# Altium schematic sheet Power Regulation.SchDoc: OTG Dock Puck
size A; Date: 12/6/2021; ApprovedBy: KEW; CheckedBy: KEW; Author: KEW; CompanyName: Gamber-Johnson LLC; Engineer: KEW; Organization: Gamber-Johnson LLC; Address1: 5001 Joerns Dr.; Address2: Stevens Point; Address3: WI, 54481; DocumentNumber: KEW-OTG; DrawnBy: KEW; RevisionEngineer: KEW; ProjectTitle: USB-OTG Puck; Revision: X2; SheetNumber: 4; SheetTotal: 5; RevisionDescription: Updated pads for X1,2 and RJ45 Port; DrawnByDate: 1/18/2023; ProjectNumber: TBD; AssemblyNumber: 7150-XXXX; RevisionDate: 1/25/2023; SheetTitle: Power Regulation; Time: 9:34 AM; Application_BuildNumber: 7150-XXX
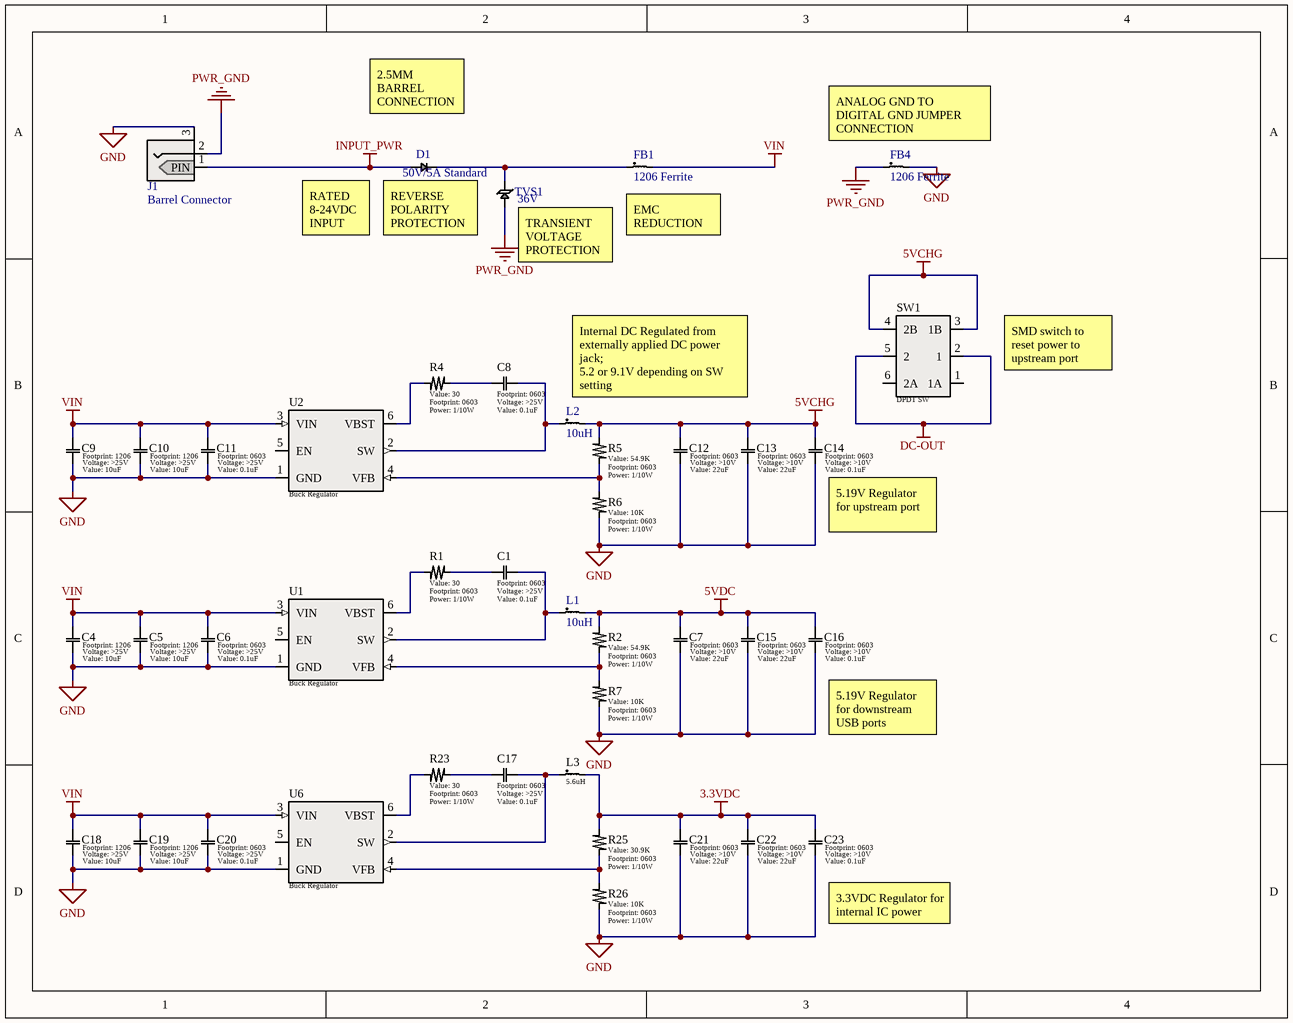
[diagram p0: Power Regulation.SchDoc]

## Parts
C1  value 0.1uF  Voltage: >25V  [0603]  (hidden comment: Generic Capacitor)
C4  value 10uF  Voltage: >25V  [1206]  (hidden comment: Generic Capacitor)
C5  value 10uF  Voltage: >25V  [1206]  (hidden comment: Generic Capacitor)
C6  value 0.1uF  Voltage: >25V  [0603]  (hidden comment: Generic Capacitor)
C7  value 22uF  Voltage: >10V  [0603]  (hidden comment: Generic Capacitor)
C8  value 0.1uF  Voltage: >25V  [0603]  (hidden comment: Generic Capacitor)
C9  value 10uF  Voltage: >25V  [1206]  (hidden comment: Generic Capacitor)
C10  value 10uF  Voltage: >25V  [1206]  (hidden comment: Generic Capacitor)
C11  value 0.1uF  Voltage: >25V  [0603]  (hidden comment: Generic Capacitor)
C12  value 22uF  Voltage: >10V  [0603]  (hidden comment: Generic Capacitor)
C13  value 22uF  Voltage: >10V  [0603]  (hidden comment: Generic Capacitor)
C14  value 0.1uF  Voltage: >10V  [0603]  (hidden comment: Generic Capacitor)
C15  value 22uF  Voltage: >10V  [0603]  (hidden comment: Generic Capacitor)
C16  value 0.1uF  Voltage: >10V  [0603]  (hidden comment: Generic Capacitor)
C17  value 0.1uF  Voltage: >25V  [0603]  (hidden comment: Generic Capacitor)
C18  value 10uF  Voltage: >25V  [1206]  (hidden comment: Generic Capacitor)
C19  value 10uF  Voltage: >25V  [1206]  (hidden comment: Generic Capacitor)
C20  value 0.1uF  Voltage: >25V  [0603]  (hidden comment: Generic Capacitor)
C21  value 22uF  Voltage: >10V  [0603]  (hidden comment: Generic Capacitor)
C22  value 22uF  Voltage: >10V  [0603]  (hidden comment: Generic Capacitor)
C23  value 0.1uF  Voltage: >10V  [0603]  (hidden comment: Generic Capacitor)
D1  50V/5A Standard  [DO-214AC]
FB1  1206 Ferrite  [1206]
FB4  1206 Ferrite  [1206]
J1  Barrel Connector  [PJ-082BH]
L1  10uH  [SMD 8.2x8.6mm]
L2  10uH  [SMD 8.2x8.6mm]
L3  5.6uH  [TMPC0402HP]
R1  value 30  Power: 1/10W  [0603]  (hidden comment: Generic Resistor)
R2  value 54.9K  Power: 1/10W  [0603]  (hidden comment: Generic Resistor)
R4  value 30  Power: 1/10W  [0603]  (hidden comment: Generic Resistor)
R5  value 54.9K  Power: 1/10W  [0603]  (hidden comment: Generic Resistor)
R6  value 10K  Power: 1/10W  [0603]  (hidden comment: Generic Resistor)
R7  value 10K  Power: 1/10W  [0603]  (hidden comment: Generic Resistor)
R23  value 30  Power: 1/10W  [0603]  (hidden comment: Generic Resistor)
R25  value 30.9K  Power: 1/10W  [0603]  (hidden comment: Generic Resistor)
R26  value 10K  Power: 1/10W  [0603]  (hidden comment: Generic Resistor)
SW1  DPDT SW  [SMD-DPDT-SW]
TVS1  36V  [DO-214AC]
U1  Buck Regulator  [TSOT-23-6]
U2  Buck Regulator  [TSOT-23-6]
U6  Buck Regulator  [TSOT-23-6]

## Nets
3.3VDC: C21.1 C22.1 C23.1 L3.2 R25.2
5VCHG: C12.1 C13.1 C14.1 L2.2 R5.2 SW1.3(1B) SW1.4(2B)
5VDC: C7.1 C15.1 C16.1 L1.2 R2.2
DC-OUT: SW1.2(1) SW1.5(2)
GND: C4.2 C5.2 C6.2 C7.2 C9.2 C10.2 C11.2 C12.2 C13.2 C14.2 C15.2 C16.2 C18.2 C19.2 C20.2 C21.2 C22.2 C23.2 FB4.2 J1.3(SHD_B) R6.1 R7.1 R26.1 U1.1(GND) U2.1(GND) U6.1(GND)
INPUT_PWR: D1.2(Anode) J1.1(PIN)
PWR_GND: FB4.1 J1.2(SHD_A) TVS1.2(Anode)
VIN: C4.1 C5.1 C6.1 C9.1 C10.1 C11.1 C18.1 C19.1 C20.1 FB1.2 U1.3(VIN) U2.3(VIN) U6.3(VIN)
NetC1_1: C1.1 R1.2
NetC1_2: C1.2 L1.1 U1.2(SW)
NetC8_1: C8.1 R4.2
NetC8_2: C8.2 L2.1 U2.2(SW)
NetC17_1: C17.1 R23.2
NetC17_2: C17.2 L3.1 U6.2(SW)
NetD1_1: D1.1(Cathode) FB1.1 TVS1.1(Cathode)
NetR1_1: R1.1 U1.6(VBST)
NetR2_1: R2.1 R7.2 U1.4(VFB)
NetR4_1: R4.1 U2.6(VBST)
NetR5_1: R5.1 R6.2 U2.4(VFB)
NetR23_1: R23.1 U6.6(VBST)
NetR25_1: R25.1 R26.2 U6.4(VFB)

Not connected (* = marked no-connect by the designer): SW1 1(1A) 6(2A); U1 5(EN); U2 5(EN); U6 5(EN)

## Notes on the sheet
- 2.5MM BARREL CONNECTION
- (near FB4) ANALOG GND TO DIGITAL GND JUMPER CONNECTION
- (near D1) RATED 8-24VDC INPUT
- (near D1) REVERSE POLARITY PROTECTION
- (near FB1) EMC REDUCTION
- (near TVS1) TRANSIENT VOLTAGE PROTECTION
- SMD switch to reset power to upstream port
- (near L2) Internal DC Regulated from
  externally applied DC power jack;
  5.2 or 9.1V depending on SW setting
- (near C14) 5.19V Regulator for upstream port
- (near C16) 5.19V Regulator for downstream USB ports
- (near C23) 3.3VDC Regulator for internal IC power
- REV
- REVISIONS
- DATE
- DESCRIPTION
- BY
- UNLESS OTHERWISE SPECIFIED, DRAWING DEFINITIONS AND TOLERANCES SHALL BE FOUND UNDER SUPPLIER STANDARDS SS-001. THIS PART AND ALL COMPONENTS OF IT MUST BE RoHS & REACH COMPLIANT. A CERTIFICATE OF COMPLIANCE MUST BE PROVIDED UPON REQUEST.
- ALL INFORMATION ON THIS DOCUMENT IS THE SOLE PROPERTY OF GAMBER-JOHNSON AND SHALL NOT BE COPIED, REPRODUCED, USED OR DISCLOSED IN WHOLE OR IN PART WITHOUT THE WRITTEN CONSENT OF GAMBER-JOHNSON
- TOLERANCES
  .00 ± .060
  .000 ± .020
  .0000 ± .005
  ANGELS ± 1°
- DRAWN BY:
- PROJECT NUMBER:
- SHEET TITLE:
- SHEET
- OF
- DATE:
- LOCATION:
- ASSEMBLY NUMBER
- SIZE
- GAMBER-JOHNSON LLC
  3001 BORHAM AVE.
  STEVENS POINT, WI 54481
  +1 (715) 344-5209
- B

## Library data of the parts
C1 C4-C6 C8-C11 C14 C16-C20 C23 = Generic Capacitor: Tolerance: 10%
C7 C12 C13 C15 C21 C22 = Generic Capacitor: Tolerance: 20%
D1 = SBRT5A50SA-13: Diode Super Barrier 50V 5A Surface Mount; Manufacturer 1: Diodes; Element Configuration: Single; Forward Voltage: 460mV; Max Forward Surge Current (Ifsm): 70A; Max Reverse Current: 45mA; Supplier 1: Digi-Key; Manufacturer Part Number 1: SBRT5A50SA-13; RoHS: Yes; Category: Rectifier Diodes; Stock 1: 218992; Pricing 1: 1=0.49000, 10=0.38200, 100=0.22900, 500=0.21200, 1000=0.14416, 2000=0.13271 (USD); Mount: Surface Mount; Case/Package: SMA; Weight: 0.002258oz; Min Operating Temperature: -55°C; Max Operating Temperature: 150°C; Packaging: Tape and Reel; Average Rectified Current: 5A; Max Repetitive Reverse Voltage (Vrrm): 50V; Package Quantity: 5000; Max Reverse Voltage (DC): 50V; Lead Free: Lead Free; RoHS Compliant: Yes; ComponentLink1URL: http://www.farnell.com/datasheets/2814462.pdf?src-supplier=Farnell; ComponentLink1Description: http://www.farnell.com/datasheets/2814462.pdf?src-supplier=Farnell; ComponentLink2URL: https://www.diodes.com/assets/Datasheets/SBRT5A50SA.pdf?src-supplier=Arrow+Electronics; ComponentLink2Description: https://www.diodes.com/assets/Datasheets/SBRT5A50SA.pdf?src-supplier=Arrow+Electronics; ComponentLink3URL: https://www.diodes.com/assets/Datasheets/SBRT5A50SA.pdf?src-supplier=Mouser; ComponentLink3Description: https://www.diodes.com/assets/Datasheets/SBRT5A50SA.pdf?src-supplier=Mouser; ComponentLink4URL: https://www.diodes.com/assets/Datasheets/SBRT5A50SA.pdf?src-supplier=Avnet+Europe; ComponentLink4Description: https://www.diodes.com/assets/Datasheets/SBRT5A50SA.pdf?src-supplier=Avnet+Europe; ComponentLink5URL: http://www.farnell.com/datasheets/2814462.pdf?src-supplier=Newark; ComponentLink5Description: http://www.farnell.com/datasheets/2814462.pdf?src-supplier=Newark; ComponentLink6URL: https://www.diodes.com/assets/Datasheets/SBRT5A50SA.pdf?src-supplier=Avnet; ComponentLink6Description: https://www.diodes.com/assets/Datasheets/SBRT5A50SA.pdf?src-supplier=Avnet; ComponentLink7URL: https://www.diodes.com/assets/Datasheets/SBRT5A50SA.pdf?src-supplier=Digi-Key; ComponentLink7Description: https://www.diodes.com/assets/Datasheets/SBRT5A50SA.pdf?src-supplier=Digi-Key; ComponentLink8URL: http://www.farnell.com/datasheets/2814462.pdf?src-supplier=Element14; ComponentLink8Description: http://www.farnell.com/datasheets/2814462.pdf?src-supplier=Element14; ComponentLink9URL: https://www.diodes.com/assets/Datasheets/SBRT5A50SA.pdf?src-supplier=Verical; ComponentLink9Description: https://www.diodes.com/assets/Datasheets/SBRT5A50SA.pdf?src-supplier=Verical; Supplier Part Number 1: SBRT5A50SA-13DICT-ND
FB1 FB4 = HI1206T161R-10: 160 Ohms @ 100MHz 1 Power, Signal Line Ferrite Bead 1206 (3216 Metric) 6A 18mOhm; Manufacturer 1: Laird Steward; DC Resistance (DCR): 18mR; Number of Lines: 1; Impedance: 160R; Supplier 1: Digi-Key; Manufacturer Part Number 1: HI1206T161R-10; RoHS: Yes; Category: Fixed Inductors; Stock 1: 250713; Pricing 1: 1=0.20000, 10=0.15600, 25=0.12920, 50=0.11140, 100=0.10020, 250=0.08464, 500=0.07572, 1000=0.06458 (USD); Mount: Surface Mount; Case/Package: 1206; Weight: 0.0136oz; Case Code (Metric): 3216; Case Code (Imperial): 1206; Core Material: Ferrite; Material: Ferrite; Min Operating Temperature: -40°C; Max Operating Temperature: 125°C; Package Quantity: 1; Packaging: Tape and Reel; Max Current Rating: 6A; Current Rating: 6A; Max DC Current: 6A; Termination: SMD/SMT; Frequency: 100MHz; Test Frequency: 100MHz; Length: 3.2mm; Height: 0.071inch; Width: 0.063inch; Depth: 1.8mm; Lead Free: Lead Free; REACH SVHC: Unknown; ComponentLink1URL: https://datasheet.ciiva.com/22622/1685743-22622771.pdf?src-supplier=Element14; ComponentLink1Description: https://datasheet.ciiva.com/22622/1685743-22622771.pdf?src-supplier=Element14; ComponentLink2URL: https://datasheet.ciiva.com/16714/70065439-16714326.pdf?src-supplier=Allied+Electronics; ComponentLink2Description: https://datasheet.ciiva.com/16714/70065439-16714326.pdf?src-supplier=Allied+Electronics; Supplier Part Number 1: 240-2411-1-ND; LCSC PN: C391193
J1 = PJ-082BH: CONN PWR JACK 2.5X5.5MM SOLDER; Manufacturer 1: CUI; Gender: Male; Shielding: Shielded; Current Rating: 10A; Number of Conductors: 2; Supplier 1: Digi-Key; Manufacturer Part Number 1: PJ-082BH; RoHS: Yes; Category: Connectors; Stock 1: 24371; Pricing 1: 1=1.69000, 10=1.53600, 25=1.44200, 50=1.37940, 100=1.31670 (USD); Mount: Through Hole; Color: Black; Contact Material: Brass; Housing Material: Nylon; Contact Plating: Silver; Housing Color: Black; Min Operating Temperature: -25°C; Max Operating Temperature: 85°C; Orientation: Horizontal; Connector Type: Jack; Termination: Solder; Lead Free: Lead Free; ComponentLink1URL: https://datasheet.ciiva.com/7368/pj-082bh-7368042.pdf?src-supplier=Digi-Key; ComponentLink1Description: https://datasheet.ciiva.com/7368/pj-082bh-7368042.pdf?src-supplier=Digi-Key; ComponentLink2URL: https://datasheet.ciiva.com/7368/pj-082bh-7368045.pdf?src-supplier=Digi-Key; ComponentLink2Description: https://datasheet.ciiva.com/7368/pj-082bh-7368045.pdf?src-supplier=Digi-Key; Supplier Part Number 1: CP-082BHCT-ND; LCSC PN: C3001296
L1 L2 = IHLP3232DZER100M5A: 5.1A 10uH ±20% 5.2A - Power Inductor; Mfr_Name: Vishay; Type: DEV; Copyright: Copyright (C) 2023 Ultra Librarian. All rights reserved.; Manufacturer_Part_Number: IHLP3232DZER100M5A; RefDes: RefDes; LCSC PN: C2051768; Supplier 1: Mouser
L3 = TMPC0402HP-5R6MG-Z02: 2A 5.6uH ±20% SMD Power Inductor; LCSC PN: C357137; Supplier 1: Digi-Key; Supplier Part Number 1: 732-3339-1-ND
R1 R2 R4-R7 R23 R25 R26 = Generic Resistor: Tolerance: 1%
SW1 = MS-22D17-G2: Brick nogging DPDT Black SMD Slide Switch; LCSC PN: C2904912
TVS1 = SMAJ36A: 58.1V Clamp 6.9A Ipp Tvs Diode Surface Mount DO-214AC (SMA); Manufacturer 1: Littelfuse; Peak Pulse Power: 400W; Polarity: Unidirectional; Breakdown Voltage: 40V; Test Current: 1mA; Number of Channels: 1; Leakage Current: 1uA; Max Power Dissipation: 3.3W; Power Line Protection: No; Max Breakdown Voltage: 44.2V; Supplier 1: Digi-Key; Manufacturer Part Number 1: SMAJ36A; RoHS: Yes; Category: TVS Diodes; Stock 1: 65200; Pricing 1: 1=0.41000, 10=0.27500, 100=0.15750, 500=0.11000, 1000=0.08750, 2000=0.08500 (USD); Mount: Surface Mount; Number of Pins: 2; Min Operating Temperature: -65°C; Max Operating Temperature: 150°C; Clamping Voltage: 58.1V; Packaging: Tape and Reel; Reverse Standoff Voltage: 36V; Peak Pulse Current: 6.9A; Max Surge Current: 6.9A; Package Quantity: 5000; Operating Supply Voltage: 36V; Reverse Breakdown Voltage: 40V; Min Breakdown Voltage: 40V; Number of Elements: 1; Termination: SMD/SMT; Direction: Unidirectional; Resistor Type: Zener; Number of Unidirectional Channels: 1; Voltage Rating (DC): 36V; Power Dissipation: 400W; Length: 5.28mm; Height: 2.29mm; Width: 2.79mm; Lead Free: Lead Free; REACH SVHC: No SVHC; ComponentLink1URL: https://datasheet.ciiva.com/330/littelfuse-tvs-diode-smaj-datasheet-pdf-330760.pdf?src-supplier=Digi-Key; ComponentLink1Description: https://datasheet.ciiva.com/330/littelfuse-tvs-diode-smaj-datasheet-pdf-330760.pdf?src-supplier=Digi-Key; ComponentLink2URL: https://datasheet.ciiva.com/330/littelfuse-tvs-diode-smaj-datasheet-pdf-330762.pdf?src-supplier=Digi-Key; ComponentLink2Description: https://datasheet.ciiva.com/330/littelfuse-tvs-diode-smaj-datasheet-pdf-330762.pdf?src-supplier=Digi-Key; ComponentLink3URL: https://datasheet.ciiva.com/28473/607617-28473423.pdf?src-supplier=Element14; ComponentLink3Description: https://datasheet.ciiva.com/28473/607617-28473423.pdf?src-supplier=Element14; ComponentLink4URL: https://datasheet.ciiva.com/330/littelfuse-tvs-diode-smaj-datasheet-pdf-330761.pdf?src-supplier=Digi-Key; ComponentLink4Description: https://datasheet.ciiva.com/330/littelfuse-tvs-diode-smaj-datasheet-pdf-330761.pdf?src-supplier=Digi-Key; ComponentLink5URL: https://datasheet.ciiva.com/16487/littelfuse-tvs-diode-smaj-16487437.pdf?src-supplier=Future+Electronics; ComponentLink5Description: https://datasheet.ciiva.com/16487/littelfuse-tvs-diode-smaj-16487437.pdf?src-supplier=Future+Electronics; Supplier Part Number 1: SMAJ36ALFCT-ND
U1 U2 U6 = TPS56339DDCR: Buck Switching Regulator IC Positive Adjustable 0.8V 1 Output 3A SOT-23-6 Thin, TSOT-23-6; Manufacturer: Texas Instruments; Supplier 1: Digi-Key; Manufacturer Part Number: TPS56339DDCR; RoHS: Yes; Category: Voltage Regulators - Switching; Pricing 1: 1=1.39000, 10=1.24100, 25=1.17840, 100=0.96790, 250=0.90476, 500=0.79956, 1000=0.69475 (USD); Supplier Part Number 1: 296-53568-6-ND; LCSC PN: C2071106